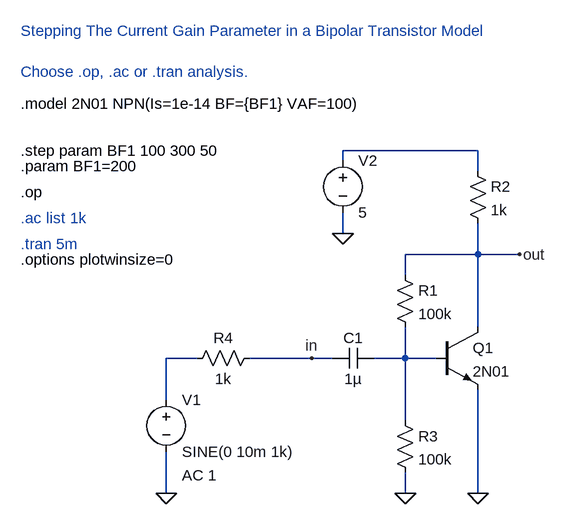
[diagram p0: schematic Bipolar_transistor_parameter_stepping2.asc]
Bipolar_transistor_parameter_stepping2.asc, the LTspice schematic file:
Version 4
SHEET 1 880 680
WIRE 160 -144 -48 -144
WIRE -48 -128 -48 -144
WIRE 160 -112 160 -144
WIRE -48 -16 -48 -48
WIRE 160 16 160 -32
WIRE 160 16 48 16
WIRE 224 16 160 16
WIRE 48 48 48 16
WIRE 160 128 160 16
WIRE -272 176 -320 176
WIRE -96 176 -192 176
WIRE -64 176 -96 176
WIRE 48 176 48 128
WIRE 48 176 0 176
WIRE 96 176 48 176
WIRE -320 240 -320 176
WIRE 48 272 48 176
WIRE -320 384 -320 320
WIRE 48 384 48 352
WIRE 160 384 160 224
FLAG 48 384 0
FLAG 160 384 0
FLAG -320 384 0
FLAG -48 -16 0
FLAG 224 16 out
FLAG -96 176 in
SYMBOL npn 96 128 R0
SYMATTR InstName Q1
SYMATTR Value 2N01
SYMBOL res 144 -128 R0
SYMATTR InstName R2
SYMATTR Value 1k
SYMBOL res 32 32 R0
SYMATTR InstName R1
SYMATTR Value 100k
SYMBOL res 32 256 R0
SYMATTR InstName R3
SYMATTR Value 100k
SYMBOL cap -64 192 R270
WINDOW 0 32 32 VTop 0
WINDOW 3 0 32 VBottom 0
SYMATTR InstName C1
SYMATTR Value 1µ
SYMBOL voltage -320 224 R0
WINDOW 123 24 132 Left 0
WINDOW 39 0 0 Left 0
SYMATTR Value2 AC 1
SYMATTR InstName V1
SYMATTR Value SINE(0 10m 1k)
SYMBOL res -288 192 R270
WINDOW 0 32 56 VTop 0
WINDOW 3 0 56 VBottom 0
SYMATTR InstName R4
SYMATTR Value 1k
SYMBOL voltage -48 -144 R0
SYMATTR InstName V2
SYMATTR Value 5
TEXT -544 -216 Left 0 !.model 2N01 NPN(Is=1e-14 BF={BF1} VAF=100)
TEXT -544 -144 Left 0 !.step param BF1 100 300 50
TEXT -544 -80 Left 0 !.op
TEXT -544 -120 Left 0 !.param BF1=200
TEXT -544 -40 Left 0 ;.ac list 1k
TEXT -544 0 Left 0 ;.tran 5m
TEXT -544 24 Left 0 !.options plotwinsize=0
TEXT -544 -328 Left 0 ;Stepping The Current Gain Parameter in a Bipolar Transistor Model\n \nChoose .op, .ac or .tran analysis.

The netlist it stands for:
* Bipolar_transistor_parameter_stepping2.asc
Q1 out N003 0 0 2N01
R2 N001 out 1k
R1 out N003 100k
R3 N003 0 100k
C1 in N003 1µ
V1 N002 0 SINE(0 10m 1k) AC 1
R4 N002 in 1k
V2 N001 0 5
.model NPN NPN
.model PNP PNP
.lib standard.bjt
.model 2N01 NPN(Is=1e-14 BF={BF1} VAF=100)
.step param BF1 100 300 50
.op
.param BF1=200
* .ac list 1k
* .tran 5m
.options plotwinsize=0
* Stepping The Current Gain Parameter in a Bipolar Transistor Model
* Choose .op, .ac or .tran analysis.
.backanno
.end